# Altium schematic sheet IPMC_TestBoard.SchDoc
size A3; Author: Marcelo Vicente; Organization: Univ. of Wisconsin-Madison; Address1: Madison, WI 53706; DocumentNumber: 1; SheetNumber: 1; SheetTotal: 5
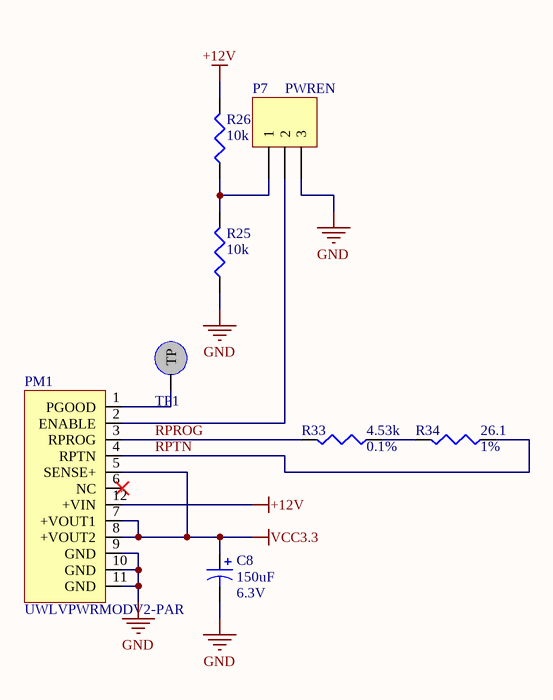
[diagram p0: IPMC_TestBoard.SchDoc]

## Parts
C8  value 150uF  Rating: 6.3V  [VISH-293D-7343-31_V]  (hidden comment: ?)
P7  PWREN  [HEADER1X3]
PM1  UWLVPWRMODV2-PAR  [UWLVPWRMODV2]
R25  value 10k  [R0402_IPC_H]  (hidden comment: ?)
R26  value 10k  [R0402_IPC_H]  (hidden comment: ?)
R33  value 4.53k  Tolerance: 0.1%  [R0402]  (hidden comment: ?)
R34  value 26.1  Tolerance: 1%  [R0402]  (hidden comment: ?)
TP1  TP  [TP]  (value not drawn)

## Nets
+12V: PM1.12(+VIN) R26.2
GND: C8.2 P7.3 PM1.9(GND) PM1.10(GND) PM1.11(GND) R25.1
VCC3.3: C8.1 PM1.5(SENSE+) PM1.7(+VOUT1) PM1.8(+VOUT2)
RPROG: PM1.3(RPROG) R33.2
RPTN: PM1.4(RPTN) R34.1
NetP7_1: P7.1 R25.2 R26.1
NetP7_2: P7.2 PM1.2(ENABLE)
NetPM1_1: PM1.1(PGOOD) TP1.1(TP)
NetR33_1: R33.1 R34.2

Not connected (* = marked no-connect by the designer): PM1 6(NC)*

## Notes on the sheet
- Description
- Title
- Size:
- Date:
- A3
- Number:
- Time:
- Revision:
- Sheet
- of
- File:
- Author:

## Library data of the parts
C8 = Cap Pol3: Polarized Capacitor (Surface Mount); Mfg. Part No.: A700X157M006ATE015; INVKEY: CP7343-150uF-6.3V-ESR15-20%; Mfgr: Kemet
P7 = Header 3: Header, 3-Pin; INVKEY: ?; Mfg. Part No.: ?; Mfgr: ?
PM1 = UWLVPWRMODV2-PAR: UW Low-voltage Power Module V2; Mfgr: University of Wisconsin; Note: Refurbish from oRSCs; INVKEY: ?; Mfg. Part No.: UWLVPWRMODV2
R25 R26 = Res: Resistor; Mfg. Part No.: ERJ-2GEJ103X; Tolerance: 5%; INVKEY: RS0402-10K-1/10W-5%; Mfgr: Panasonic-ECG
R33 = Res: Resistor; Mfg. Part No.: ERA-2AEB4531X; INVKEY: RS0402-4K53-1/16W-PREC; Mfgr: Panasonic-ECG
R34 = Res: Resistor; Mfg. Part No.: ERJ-2RKF26R1X; INVKEY: RS0402-26R1-1/10W-1%; Mfgr: Panasonic-ECG
TP1 = TP: Test Point; INVKEY: NA; Note: Not a part; Mfg. Part No.: NA; Mfgr: NA